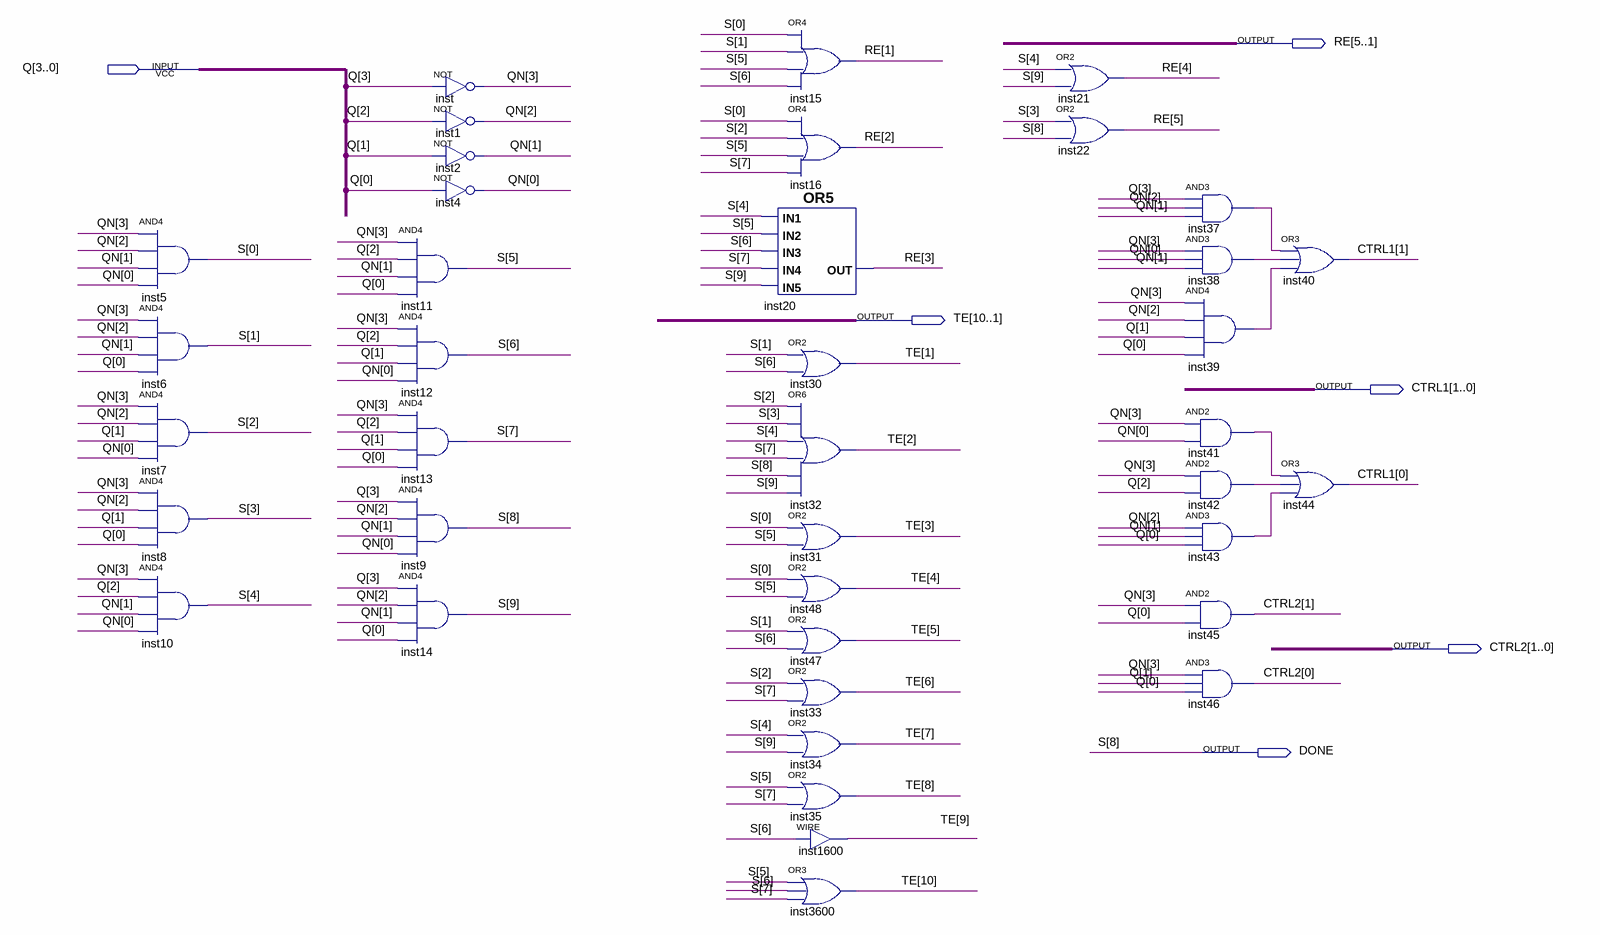
[diagram p0: schematic sheet]
// Quartus schematic OUTPUT.bdf as structural Verilog: 39 symbols, 6 pins
module OUTPUT (
  input  [3:0] Q,
  output [5:1] RE,
  output [10:1] TE,
  output [1:0] CTRL1,
  output [1:0] CTRL2,
  output DONE
);

  wire inst37_out, inst38_out, inst39_out, inst41_out, inst42_out, inst43_out;
  wire [3:0] QN;
  wire [9:0] S;

  and inst5 (S[0], QN[3], QN[2], QN[1], QN[0]);
  and inst6 (S[1], QN[3], QN[2], QN[1], Q[0]);
  and inst7 (S[2], QN[3], QN[2], Q[1], QN[0]);
  and inst8 (S[3], QN[3], QN[2], Q[1], Q[0]);
  and inst10 (S[4], QN[3], Q[2], QN[1], QN[0]);
  and inst11 (S[5], QN[3], Q[2], QN[1], Q[0]);
  and inst12 (S[6], QN[3], Q[2], Q[1], QN[0]);
  and inst13 (S[7], QN[3], Q[2], Q[1], Q[0]);
  and inst9 (DONE, Q[3], QN[2], QN[1], QN[0]);
  and inst14 (S[9], Q[3], QN[2], QN[1], Q[0]);
  not inst (QN[3], Q[3]);
  not inst1 (QN[2], Q[2]);
  not inst2 (QN[1], Q[1]);
  not inst4 (QN[0], Q[0]);
  or inst20 (RE[3], S[4], S[5], S[6], S[7], S[9]);
  or inst15 (RE[1], S[0], S[1], S[5], S[6]);
  or inst16 (RE[2], S[0], S[2], S[5], S[7]);
  or inst30 (TE[1], S[1], S[6]);
  or inst32 (TE[2], S[2], S[3], S[4], S[7], DONE, S[9]);
  or inst31 (TE[3], S[0], S[5]);
  or inst48 (TE[4], S[0], S[5]);
  or inst47 (TE[5], S[1], S[6]);
  or inst33 (TE[6], S[2], S[7]);
  or inst34 (TE[7], S[4], S[9]);
  or inst35 (TE[8], S[5], S[7]);
  assign TE[9] = S[6];  // WIRE inst1600
  or inst3600 (TE[10], S[5], S[6], S[7]);
  or inst21 (RE[4], S[4], S[9]);
  or inst22 (RE[5], S[3], DONE);
  and inst37 (inst37_out, Q[3], QN[2], QN[1]);
  and inst38 (inst38_out, QN[3], QN[0], QN[1]);
  and inst39 (inst39_out, QN[3], QN[2], Q[1], Q[0]);
  and inst41 (inst41_out, QN[3], QN[0]);
  and inst42 (inst42_out, QN[3], Q[2]);
  and inst43 (inst43_out, QN[2], QN[1], Q[0]);
  and inst45 (CTRL2[1], QN[3], Q[0]);
  and inst46 (CTRL2[0], QN[3], Q[1], Q[0]);
  or inst40 (CTRL1[1], inst37_out, inst38_out, inst39_out);
  or inst44 (CTRL1[0], inst41_out, inst42_out, inst43_out);

  // Other names for the same wires on the sheet: S[8] = DONE
endmodule
